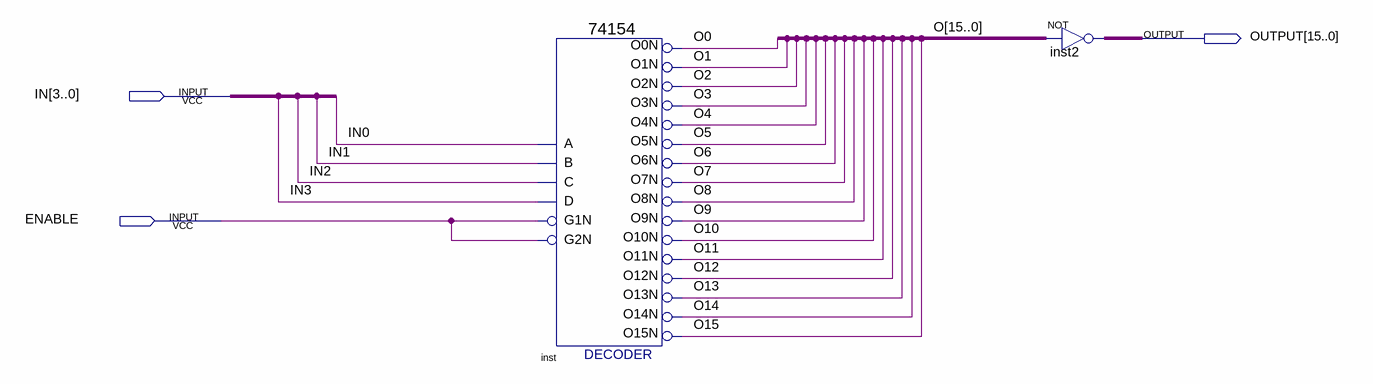
[diagram p0: schematic sheet]
// Quartus schematic Decode.bdf as structural Verilog: 2 symbols, 3 pins
module Decode (
  input  [3:0] IN,
  input  ENABLE,
  output [15:0] OUTPUT
);

  wire [15:0] O;

  \74154  inst (
    .C(IN[2]), .D(IN[3]), .B(IN[1]), .A(IN[0]), .G1N(ENABLE), .G2N(ENABLE), .O0N(O[0]), .O12N(O[12]),
    .O15N(O[15]), .O10N(O[10]), .O11N(O[11]), .O1N(O[1]), .O13N(O[13]), .O14N(O[14]), .O4N(O[4]), .O3N(O[3]),
    .O2N(O[2]), .O7N(O[7]), .O6N(O[6]), .O5N(O[5]), .O9N(O[9]), .O8N(O[8]));
  assign OUTPUT = ~O;  // NOT inst2, 16 bits wide
endmodule
